# EAGLE design EC 4 Pin 2.0 - edited (EAGLE 9.6.2)
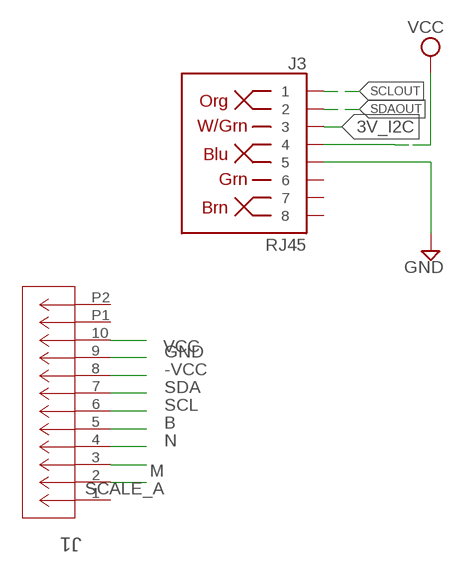
[diagram p0: schematic, sheet 1, part 1 of 2]
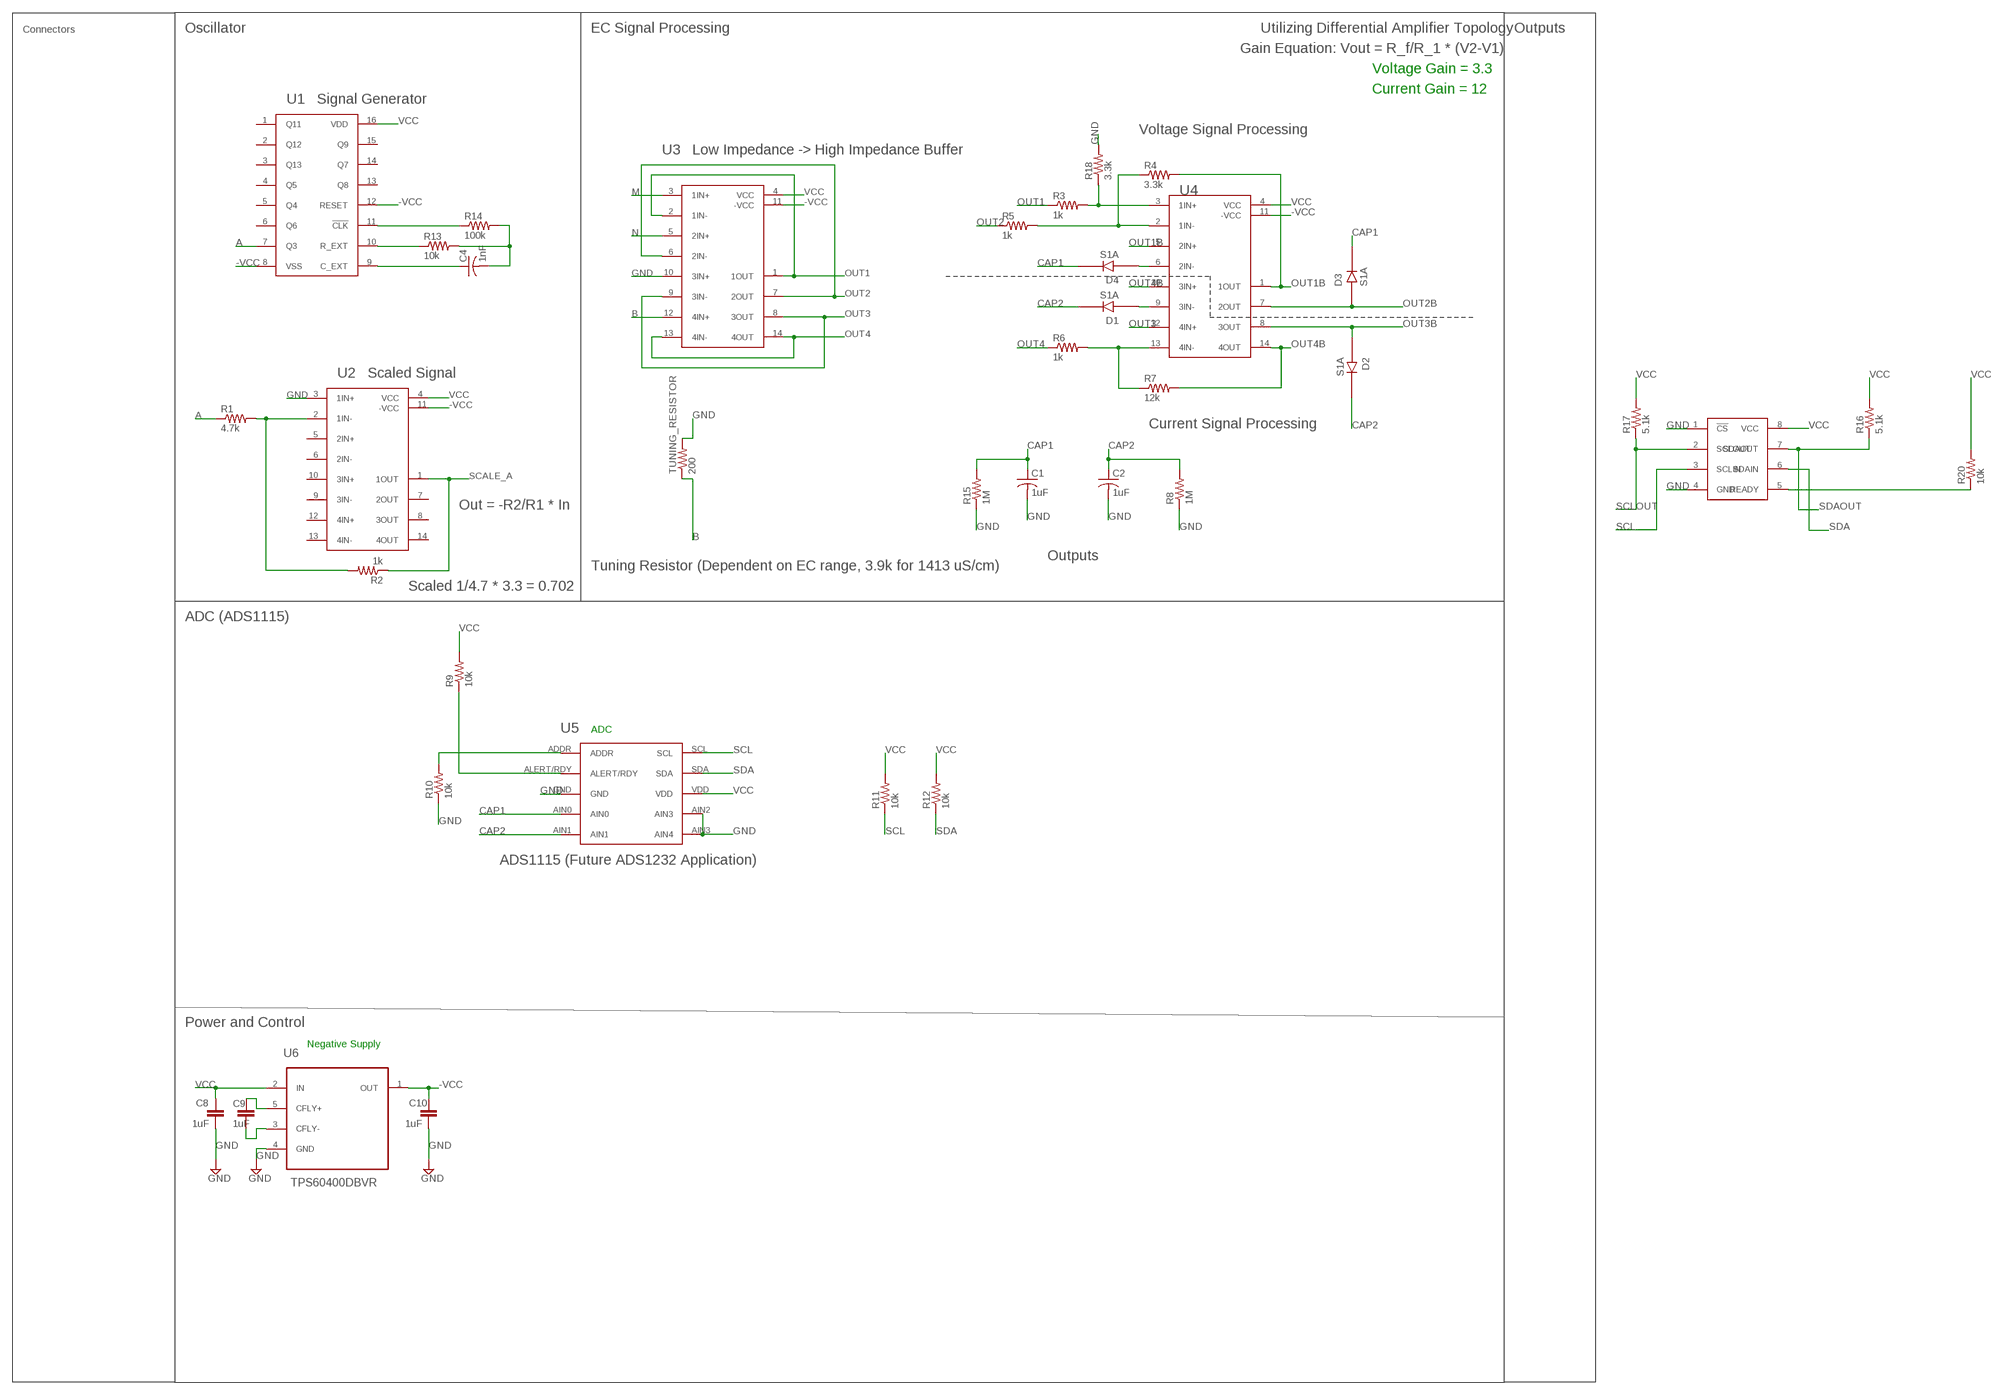
[diagram p1: schematic, sheet 1, part 2 of 2]

## Parts
C1  1uF  C-US025-024X044  [C025-024X044]
C2  1uF  C-US025-024X044  [C025-024X044]
C4  1nF  C-USC1206  [C1206]
C8  1uF  C-EUC1206  [C1206]
C9  1uF  C-EUC1206  [C1206]
C10  1uF  C-EUC1206  [C1206]
D1  S1A  [DIOM5227X270N]
D2  S1A  [DIOM5227X270N]
D3  S1A  [DIOM5227X270N]
D4  S1A  [DIOM5227X270N]
J1  522711079  [CON_522711079_MOL]
J3  RJ45  RJ45-8  [RJ45-8]
R1  4.7k  R-US_M1206  [M1206]
R2  1k  R-US_M1206  [M1206]
R3  1k  R-US_M1206  [M1206]
R4  3.3k  R-US_M1206  [M1206]
R5  1k  R-US_M1206  [M1206]
R6  1k  R-US_M1206  [M1206]
R7  12k  R-US_M1206  [M1206]
R8  1M  R-US_M1206  [M1206]
R9  10k  R-US_M1206  [M1206]
R10  10k  R-US_M1206  [M1206]
R11  10k  R-US_M1206  [M1206]
R12  10k  R-US_M1206  [M1206]
R13  10k  R-US_M1206  [M1206]
R14  100k  R-US_M1206  [M1206]
R15  1M  R-US_M1206  [M1206]
R16  5.1k  R-US_M1206  [M1206]
R17  5.1k  R-US_M1206  [M1206]
R18  3.3k  R-US_M1206  [M1206]
R20  10k  R-US_M1206  [M1206]
TUNING_RESISTOR  200  R-US_M1206  [M1206]
U1  CD4060BPWR  [CD4060BPWR]
U2  TL074CPWR  [LT074CPWR]
U3  TL074CPWR  [LT074CPWR]
U4  TL074CPWR  [LT074CPWR]
U5  ADS1115  [ADS1115]
U6  TPS60400DBVR  [SOT95P280X145-5N]
U$1  LTC4301  [LTC4301]

## Nets
3V_I2C: J3.3
-VCC: C10.2 J1.8 U1.8(VSS) U1.12(RESET) U2.11(-VCC) U3.11(-VCC) U4.11(-VCC) U6.1(OUT)
A: R1.1 U1.7(Q3)
B: J1.5 TUNING_RESISTOR.1 U3.12(4IN+)
CAP1: C1.1 D3.1(C) D4.1(C) R15.2 U5.AIN0
CAP2: C2.1 D1.1(C) D2.1(C) R8.2 U5.AIN1
GND: C1.2 C2.2 C8.1 C10.1 J1.9 J3.5 R8.1 R10.1 R15.1 R18.2 TUNING_RESISTOR.2 U2.3(1IN+) U3.10(3IN+) U5.AIN2(AIN3) U5.AIN3(AIN4) U5.GND U6.4(GND) U$1.1(!CS) U$1.4(GND)
M: J1.3 U3.3(1IN+)
N: J1.4 U3.5(2IN+)
N$1: R3.2 R18.1 U4.3(1IN+)
N$2: R4.1 R5.2 U4.2(1IN-)
N$3: R1.2 R2.2 U2.2(1IN-)
N$4: D4.2(A) U4.6(2IN-)
N$5: R6.2 R7.1 U4.13(4IN-)
N$6: D1.2(A) U4.9(3IN-)
N$10: C4.1 U1.9(C_EXT)
N$11: R13.1 U1.10(R_EXT)
N$12: R14.1 U1.11(!CLK)
N$13: R10.2 U5.ADDR
N$15: R9.1 U5.ALERT/RDY
N$16: R20.1 U$1.5(READY)
N$17: C4.2 R13.2 R14.2
N$27: C9.2 U6.5(CFLY+)
N$28: C9.1 U6.3(CFLY-)
OUT1: R3.1 U3.1(1OUT) U3.2(1IN-)
OUT1B: R4.2 U4.1(1OUT) U4.5(2IN+)
OUT2: R5.1 U3.6(2IN-) U3.7(2OUT)
OUT2B: D3.2(A) U4.7(2OUT)
OUT3: U3.8(3OUT) U3.9(3IN-) U4.12(4IN+)
OUT3B: D2.2(A) U4.8(3OUT)
OUT4: R6.1 U3.13(4IN-) U3.14(4OUT)
OUT4B: R7.2 U4.10(3IN+) U4.14(4OUT)
SCALE_A: J1.2 R2.1 U2.1(1OUT)
SCL: J1.6 R11.1 U5.SCL U$1.3(SCLIN)
SCLOUT: J3.1 R17.1 U$1.2(SCLOUT)
SDA: J1.7 R12.1 U5.SDA U$1.6(SDAIN)
SDAOUT: J3.2 R16.1 U$1.7(SDAOUT)
VCC: C8.2 J1.10 J3.4 R9.2 R11.2 R12.2 R16.2 R17.2 R20.2 U1.16(VDD) U2.4(VCC) U3.4(VCC) U4.4(VCC) U5.VDD U6.2(IN) U$1.8(VCC)
Unconnected: J1.1 J1.P1 J1.P2 J3.6 J3.7 J3.8 U1.1(Q11) U1.2(Q12) U1.3(Q13) U1.4(Q5) U1.5(Q4) U1.6(Q6) U1.13(Q8) U1.14(Q7) U1.15(Q9) U2.5(2IN+) U2.6(2IN-) U2.7(2OUT) U2.8(3OUT) U2.9(3IN-) U2.10(3IN+) U2.12(4IN+) U2.13(4IN-) U2.14(4OUT)

## Notes on the sheet
- Connectors | Oscillator | EC Signal Processing | Utilizing Differential Amplifier Topology | Outputs
- Gain Equation: Vout = R_f/R_1 * (V2-V1)
- Voltage Gain = 3.3
- Current Gain = 12
- U1 | Signal Generator
- Voltage Signal Processing
- U3 | Low Impedance -> High Impedance Buffer
- U4
- U2 | Scaled Signal
- Current Signal Processing
- Out = -R2/R1 * In
- Outputs
- Tuning Resistor (Dependent on EC range, 3.9k for 1413 uS/cm)
- Scaled 1/4.7 * 3.3 = 0.702
- ADC (ADS1115)
- U5 | ADC
- ADS1115 (Future ADS1232 Application)
- Power and Control
- Negative Supply

## Library data of the parts
C1 C2 C4 = adafruit:C-US: CAPACITOR, American symbol
C8-C10 = rcl:C-EU: CAPACITOR, European symbol; SPICEPREFIX: C
D1-D4 = S1A:S1A: Rectifier Diode Switching 50V 1A 2-Pin DO-214AC T/R Rectifier Diode Switching 50V 1A 2-Pin DO-214AC T/R; DESCRIPTION: Diode Standard 50 V 1A Surface Mount DO-214AC (SMA); DIGI-KEY_PART_NUMBER: S1AFSTR-ND; MF: ON Semiconductor; MP: S1A; PACKAGE: SMA-2 ON Semiconductor; PURCHASE-URL: https://pricing.snapeda.com/search/part/S1A/?ref=eda
J1 = 52271109:522711079; COPYRIGHT: Copyright (C) 2023 Ultra Librarian. All rights reserved.; MANUFACTURER_PART_NUMBER: 522711079; MFR_NAME: Molex Connector Corporation
J3 = SparkFun-Connectors:RJ45-8: RJ45 Jack - 8 pin Simple RJ45, 8-pin connection. Commonly used for Cat5, Cat5e, and Cat6 Ethernet cables. Here is the connector we sell at SparkFun: RJ45 8-Pin Connector <https://www.sparkfun.com/products/643> (PRT-00643) Datasheet <https://cdn.sparkfun.com/datasheets/Prototyping/04908.pdf> It is used on this SparkFun product: SparkFun RJ45 Breakout <https://www.sparkfun.com/products/716> (BOB-00716) Note, you may also be interested in the "MAGJACK" version of this. It is basically a RJ45 connector, but also has some status LEDs built into the connector housing. You can check that out in this library at the device named "MAGJACK.dev" and see these products online: RJ45 Ethernet MagJack-Compatible <https://www.sparkfun.com/products/8534> (PRT-08534) SparkFun RJ45 MagJack Breakout <https://www.sparkfun.com/products/13021> (BOB-13021); PROD_ID: CONN-08506; SF_ID: PRT-00643
R1-R18 R20 TUNING_RESISTOR = adafruit:R-US_: RESISTOR, American symbol
U1 = PNNL_Wenner:CD4060BPWR
U2-U4 = PNNL_Wenner:TL074CPWR
U5 = my_lib:ADS1115
U6 = TPS60400DBVR:TPS60400DBVR: Unregulated 60mA charge pump Voltage Inverter; AVAILABILITY: Unavailable; DESCRIPTION: 60mA Charge Pump Voltage Inverter with Variable Switching Frequency 5-SOT-23 -40 to 85; MF: Texas Instruments; MP: TPS60400DBVR; PACKAGE: SOT-23-5 Texas Instruments; PRICE: None
U$1 = my_lib:LTC4301

## Net classes
0 default: width 0.305 mm

## Board
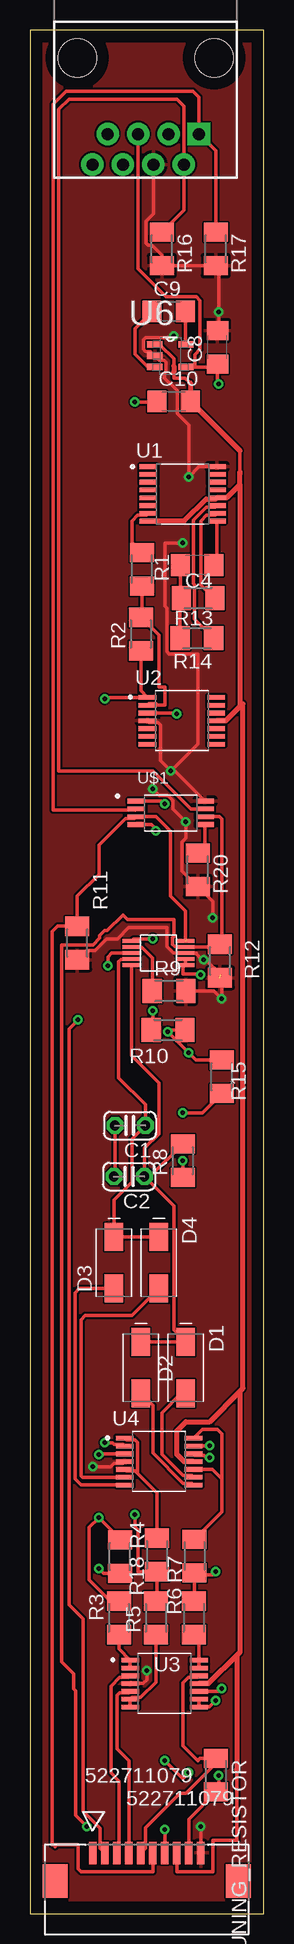
[diagram p2: board, top side]
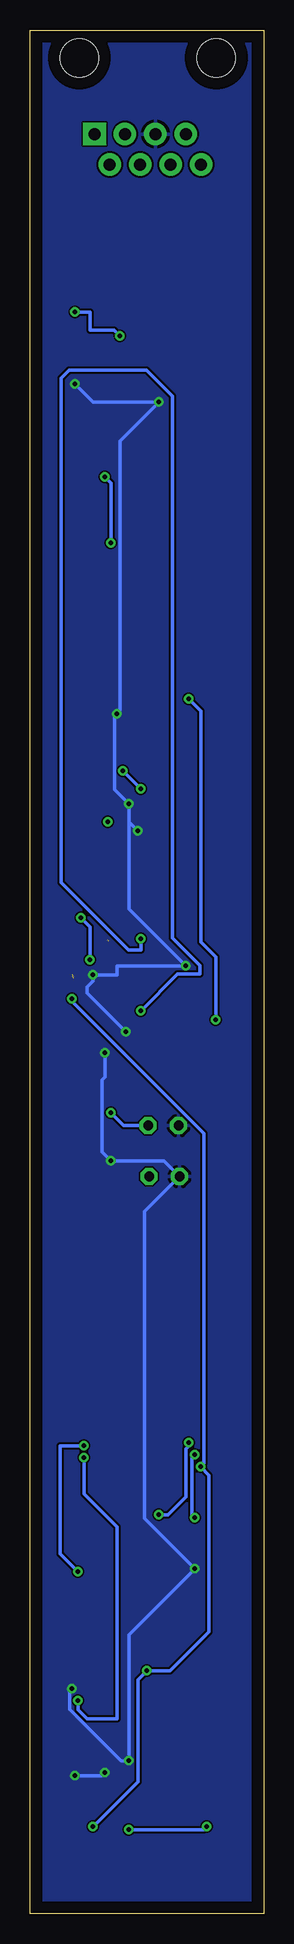
[diagram p3: board, bottom side, seen from below]

Size 19.5 x 157 mm. Coordinates in mm from the lower left corner, seen from the top.
Outline: 0,0 19.5,0 19.5,157 0,157 0,0
Copper layers (1*16): Top 0.035mm / dielectric 1.5mm / Bottom 0.035mm
Design rules "default": minimum track width 6mil, minimum drill 0.35mm, track to track 6mil, track to pad 6mil, pad to pad 6mil, via to via 6mil, smd to smd 6mil, copper to edge 40mil, drill to drill 6mil, minimum pad ring 10mil, minimum via ring 8mil, stop-mask expansion 4mil, vias tented up to drill 0mil, thermal gap 10mil

### Footprints (pad centres in the part's own frame; a part is rotated, then mirrored left to right if it is on the bottom)
C025-024X044 = drill 0.813 pad 1.422 octagon: 1 -1.27,0; 2 1.27,0
C1206 = smd 1.6 x 1.8: 1 -1.4,0; 2 1.4,0
DIOM5227X270N = smd 2.33 x 1.56: 1 -2.14,0; 2 2.14,0
CON_522711079_MOL = smd 0.6 x 1.9: 1 -4.5,3.05; 2 -3.5,3.05; 3 -2.5,3.05; 4 -1.5,3.05; 5 -0.5,3.05; 6 0.5,3.05; 7 1.5,3.05; 8 2.5,3.05; 9 3.5,3.05; 10 4.5,3.05 | smd 2.1 x 2.8: P1 -7.65,0.7; P2 7.65,0.7
RJ45-8 = drill 1 pad 1.88 square: 1 -4.445,6.35 | drill 1 pad 1.88: 2 -3.175,8.89; 3 -1.905,6.35; 4 -0.635,8.89; 5 0.635,6.35; 6 1.905,8.89; 7 3.175,6.35; 8 4.445,8.89 | hole 3.2: -5.715,0; 5.715,0
M1206 = smd 1.6 x 2: 1 -1.4,0; 2 1.4,0
CD4060BPWR = smd 1.57 x 0.41: 1 -2.87,2.275; 2 -2.87,1.625; 3 -2.87,0.975; 4 -2.87,0.325; 5 -2.87,-0.325; 6 -2.87,-0.975; 7 -2.87,-1.625; 8 -2.87,-2.275; 9 2.87,-2.275; 10 2.87,-1.625; 11 2.87,-0.975; 12 2.87,-0.325; 13 2.87,0.325; 14 2.87,0.975; 15 2.87,1.625; 16 2.87,2.275
LT074CPWR = smd 1.57 x 0.41: 1 -2.87,1.95; 2 -2.87,1.3; 3 -2.87,0.65; 4 -2.87,0; 5 -2.87,-0.65; 6 -2.87,-1.3; 7 -2.87,-1.95; 8 2.87,-1.95; 9 2.87,-1.3; 10 2.87,-0.65; 11 2.87,0; 12 2.87,0.65; 13 2.87,1.3; 14 2.87,1.95
ADS1115 = smd 1.5 x 0.318: ADDR -0.75,2.5; AIN0 -0.75,1; AIN1 -0.75,0.5; AIN2 3.75,0.5; AIN3 3.75,1; ALERT/RDY -0.75,2; GND -0.75,1.5; SCL 3.75,2.5; SDA 3.75,2; VDD 3.75,1.5
SOT95P280X145-5N = smd 1.27 x 0.559: 1 -1.295,0.94; 2 -1.295,0; 3 -1.295,-0.94; 4 1.295,-0.94; 5 1.295,0.94
LTC4301 = smd 1.57 x 0.41: 1 -2.87,0.975; 2 -2.87,0.325; 3 -2.87,-0.325; 4 -2.87,-0.975; 5 2.87,-0.975; 6 2.87,-0.325; 7 2.87,0.325; 8 2.87,0.975

### Placement (x,y rotation side)
C1  8.36,65.68 180 top
C2  8.28,61.43 180 top
C4  13.96,112.4 180 top
C8  15.66,130.55 90 top
C9  11.58,133.55 0 top
C10  12,126.05 0 top
D1  13,45.5 270 top
D2  9.25,45.5 270 top
D3  7,54.25 270 top
D4  10.75,54.25 270 top
J1  9.75,2 0 top
J3  9.66,154.68 180 top
R1  9.34,112.05 270 top
R2  9.26,106.65 90 top
R3  7.43,24.65 90 top
R4  10.6,29.9 90 top
R5  10.52,24.65 90 top
R6  13.69,24.65 90 top
R7  13.74,29.8 90 top
R8  12.75,62.75 90 top
R9  11.61,76.9 0 top
R10  11.53,73.65 180 top
R11  3.95,80.9 270 top
R12  15.87,79.4 270 top
R13  14.04,109.65 180 top
R14  13.94,106.3 180 top
R15  16,69.75 270 top
R16  11,138.75 270 top
R17  15.5,138.75 270 top
R18  7.5,29.75 270 top
R20  14,87 270 top
TUNING_RESISTOR  15.54,11.55 270 top
U1  12.75,118.33 0 top
U2  12.68,99.42 0 top
U3  11.23,19.17 0 top
U4  10.78,37.67 0 top
U5  9.21,78.56 0 top
U6  11.72,129.85 0 top
U$1  11.75,91.75 0 top

### Tracks (layer width: path | path; a pad name or v marks a point on that pad's centre or on a via)
-VCC
  Top 0.305: 17.53,121.92 17.53,120 | 10.46,130.75 10.87,130.75 12,129.62 12,129 | 13.35,127.6 12.95,128 12,128 12,128.5 | J1.8 12.25,3.5 15.25,3.5 15.25,6.12 17.25,6.12 17.25,10 17.25,12 | J1.8
  Top 0.406: 10.46,130.75 U6.1 | 13.35,127.6 13.4,127.55 C10.2 17.53,121.92 | 12,129 12,128.5 | U1.8 12.86,116.06 14.72,117.92 15.53,117.92 U1.12 16.43,118 17.53,119.1 | U2.11 16.36,99.42 17.53,100.59 | U3.11 14.91,19.17 17.25,21.51 | 17.53,43.53 17.53,21.79 17.25,21.51 | U4.11 12.84,37.67 12.25,38.26 12.25,40.25 13,41 15,41 17.53,43.53 | 17.53,43.53 17.78,43.78 17.78,100.84 17.53,100.59 | 17.53,119.1 17.53,120 17.53,120.17 | 17.53,119.1 17.53,100.59 | 17.25,21.51 17.25,12
A
  Top 0.305: U1.7 9.74,116.56 9,116.56 8.5,116.07 8.5,114.29 R1.1
B
  Top 0.305: U3.12 13.96,19.68 13.22,19.68 12.75,19.21 12.75,14 14,12.75 14.2,12.95 TUNING_RESISTOR.1 15.54,12.53 13.02,10 12.54,10 12.48,9.95 12.48,9.97 9.65,7.13 9.65,5.45 J1.5
CAP1  (via drill 0.35)
  Top 0.305: D4.1 D3.1 7,59.5 8.5,61 8.5,64.55 C1.1 9.63,67.43 7.41,69.66 7.41,79.34 7.58,79.52 8.42,79.52 U5.AIN0 | R15.2 14.4,66.75 v12.75,66.75
  Bottom 0.305: C1.1 11.68,65.68 v12.75,66.75
CAP2
  Top 0.305: D2.1 D1.1 12,48.64 12,58.98 C2.1 | C2.1 9.55,63.8 10.75,65 10.75,69.25 8.46,71.54 U5.AIN1 | C2.1 10.03,61.43 R8.2
GND  (via drill 0.35)
  Top 0.305: 12.92,79.6 U5.AIN3 U5.AIN2 12.75,78.85 12.75,78.31 14.19,78.31 v14.25,78.25 | U6.4 13.75,128.91 | 13.75,128.91 15.42,128.91 C8.1 15.66,127.59 v15.75,127.5 | U3.10 15.77,18.52 v16,18.75 | R10.1 11.65,73.65 v11.5,73.5 v13.25,71.75 13.85,71.15 R15.1 15.15,71.15 | U5.GND 6.81,80.06 6.5,79.75 v6.5,79 | U2.3 12.18,100.07 v12.25,100 | C10.1 10.55,126 v8.75,126 | R8.1 v12.75,62.75 | v15.75,11.5 15.75,10.15 TUNING_RESISTOR.2 13.25,7.86 J1.9 | v11.25,12.75 12.75,11.25 v13.25,11.75 | U$1.1 11.02,92.72 v11.25,92.5 | U$1.4 10.13,90.78 10.5,90.41 v10.5,90.25 | R18.2 6.15,28.35 v5.75,28.75 | 13.75,128.91 13.75,129.93 14.2,130.38 14.2,134.46 13.91,134.75 11.36,134.75 9.02,137.09 J3.5 | C1.2 7.09,61.51 C2.2 | J1.9
  Bottom 0.305: v11.25,92.5 11.25,83.75 v6.5,79 12.25,79 12.25,78.25 v14.25,78.25 14.25,77.75 14.75,77.25 14.75,76.75 v11.5,73.5 | v15.75,127.5 14.25,126 v8.75,126 12,122.75 12,100.25 v12.25,100 12.43,99.82 12.43,93.68 v11.25,92.5 | v10.5,90.25 11.25,91 v11.25,92.5 | v15.75,11.5 13.5,11.5 v13.25,11.75 | v16,18.75 16.18,18.57 16.18,17.04 11.9,12.75 v11.25,12.75 11.25,23.25 v5.75,28.75 9.93,32.93 9.93,58.51 C2.2 8.33,62.75 v12.75,62.75 13.5,63.5 13.5,69.5 13.25,69.75 v13.25,71.75
  pour Bottom: 0.25,157.25 19.5,157.25 19.5,0.25 0.25,0.25
M
  Top 0.305: U3.3 8.22,19.68 7.48,19.68 6.75,18.95 6.75,11.72 7.43,11.03 7.43,5.23 J1.3
N
  Top 0.305: U3.5 8.22,18.38 7.48,18.38 7.27,18.17 7.27,13.73 8.25,12.75 J1.4 8.25,5.75 | 8.25,5.75
N$1  (via drill 0.35)
  Top 0.305: v5.75,38.25 5.82,38.32 U4.3 | R18.1 7.5,31.25 v5.75,33 4.93,32.18 4.93,27.8 6.68,26.05 R3.2
  Bottom 0.305: v5.75,38.25 6,38 6,33.25 v5.75,33
N$2  (via drill 0.35)
  Top 0.305: R5.2 10.6,26.13 R4.1 9,28.5 9,32 8.75,32.25 v8.75,33.25 | U4.2 7.77,39.11 7.03,39.11 6.89,39.25 v6.25,39.25
  Bottom 0.305: v8.75,33.25 8,33.25 6.5,34.75 6.5,38.75 6.25,39 v6.25,39.25
N$3
  Top 0.305: R1.2 9.34,108.13 R2.2 10.75,106.56 10.75,102.25 11.25,102.25 11.25,100.75 10.61,100.75 10.5,100.86 9.95,100.86 U2.2
N$4
  Top 0.305: D4.2 8.5,49.86 4.61,49.86 4.25,49.5 4.25,36.5 4.38,36.37 U4.6
N$5  (via drill 0.35)
  Top 0.305: R7.1 13.74,28.25 | 13.74,28.25 13.74,26.1 R6.2 | U4.13 13.68,39 v15,39 | v15.5,28.5 15.25,28.25 13.74,28.25
  Bottom 0.305: v15,39 17,39 17,30 v15.5,28.5
N$6
  Top 0.305: D1.2 12.61,43.36 11,41.75 11,38.28 12.77,36.51 13.51,36.51 U4.9
N$10
  Top 0.305: U1.9 15.62,112.66 C4.1
N$11
  Top 0.305: U1.10 15.48,116.56 14.74,116.56 14.25,116.08 14.25,110.75 15.35,109.65 R13.1
N$12
  Top 0.305: R14.1 13.74,107.89 13.74,110.78 13.66,110.86 13.66,116.14 14.74,117.22 15.48,117.22 U1.11
N$13  (via drill 0.35)
  Top 0.305: R10.2 10.25,73.77 v10.25,75.25 | U5.ADDR 8.65,81.25 v10.25,81.25
  Bottom 0.305: 10.25,80.32 11.28,80.32 16.89,85.92 16.89,127.97 16.22,128.64 9.78,128.64 7.61,126.47 7.61,81.33 5.32,79.03 5.32,78.32 7.18,78.32 v10.25,75.25 | 10.25,80.32 10.22,80.32 | 10.25,80.32 v10.25,81.25
N$15
  Top 0.305: U5.ALERT/RDY 8.5,80.52 9.34,80.52 10.21,79.65 R9.1
N$16
  Top 0.305: U$1.5 14.62,89.02 R20.1
N$17
  Top 0.305: R14.2 12.54,109.55 R13.2 12.56,109.73 C4.2
N$27
  Top 0.305: U6.5 12.98,130.82 C9.2
N$28
  Top 0.305: U6.3 9.84,128.91 8.75,130 8.75,132.12 C9.1
OUT1
  Top 0.305: U3.2 U3.1 7.43,22.05 R3.1
OUT1B
  Top 0.305: U4.5 8.05,36.88 8.79,36.88 9,36.67 | R4.2 10.6,35.07 9,36.67 | U4.1 8.05,39.48 8.79,39.48 9,39.27 9,36.67
OUT2
  Top 0.305: U3.7 U3.6 8.5,18.01 9.24,18.01 10.52,19.29 R5.1
OUT2B
  Top 0.305: U4.7 4.28,35.72 3.75,36.25 3.75,51.75 4.11,52.11 D3.2
OUT3  (via drill 0.35)
  Top 0.305: U3.9 U3.8 14.97,17.22 v15.5,17.75 | v15,38 14.71,38 14.53,38.18 13.79,38.18 U4.12
  Bottom 0.305: v15.5,17.75 15.5,17 14.75,16.25 12.25,16.25 12.25,32.25 15,35 v15,38
OUT3B
  Top 0.305: D2.2 10.25,42.36 10.25,38.38 12.77,35.86 13.51,35.86 U4.8
OUT4
  Top 0.305: U3.13 U3.14 14.1,22.84 R6.1
OUT4B
  Top 0.305: R7.2 16,33.46 16,36.25 | 16,36.25 16,40 15.63,40.37 14.4,40.37 U4.14 | U4.10 15.23,37.02 16,36.25
SCALE_A  (via drill 0.35)
  Top 0.305: R2.1 9.26,101.92 U2.1 6.37,101.37 v6.25,101.25 | v4,74.5 3.25,73.75 3.25,25.75 4.44,24.56 4.44,8.53 5.85,7.11 5.85,5.45 J1.2 6,5.3
  Bottom 0.305: v4,74.5 4,79.75 5.25,81 5.25,100.25 v6.25,101.25
SCL  (1 unrouted)
  Top 0.305: 2.1,5.75 2.1,5.54 | 13.03,81.13 12.96,81.21 12.96,83.56 11.71,84.81 11.71,90.22 10.5,91.42 U$1.3 8.74,91.28 8,91.28 5.76,89.05 5.76,86.61 3.95,84.8 R11.1 2.3,82.3 1.85,81.85 1.85,81.32 1.85,81.25 1.85,5.75 2.1,5.75 | 2.1,5.75 4,5.75 4,3.75 4.25,3.5 10.25,3.5 | 10.25,3.5 | 10.25,3.5 J1.6
SCLOUT
  Top 0.305: U$1.2 8.8,92 1.92,92 1.92,150.83 3,151.91 13.59,151.91 14.1,151.4 J3.1 15.5,146.94 R17.1
SDA  (via drill 0.35)
  Top 0.305: U$1.6 15.83,91.42 16,91.25 16,80.93 R12.1 15.87,80.56 U5.SDA 12.8,80.56 12.76,80.6 12.08,80.6 11.91,80.78 11.91,81.34 12.01,81.45 12.01,82.84 8.16,82.84 7.75,83.25 6.43,81.93 6.22,81.93 5.82,81.53 5.82,81.3 5.26,80.74 5.25,80.75 2.63,80.75 2.63,20.98 3.63,19.98 3.63,18.75 3.81,18.57 3.81,8.19 v4.75,7.25 | v11.25,7 | v11.25,7 J1.7
  Bottom 0.305: v11.25,7 5,7 v4.75,7.25
SDAOUT
  Top 0.305: R16.1 12.84,141.99 J3.2 12.84,150.66 12.25,151.25 3.25,151.25 2.38,150.38 2.38,95.25 10.25,95.25 13.42,92.08 U$1.7
VCC  (via drill 0.35)  (1 unrouted)
  Top 0.305: J3.4 10.3,141.68 9.7,141.08 9.7,139.22 9.87,139.04 10.2,139.04 11,138.25 R16.2 14.65,137.35 14.75,137.25 15.4,137.25 | 12.99,76.9 R9.2 15.35,76.9 v16,76.25 16,77.87 R12.2 | 15.4,137.25 R17.2 | 15.5,132.11 C8.2 15.75,132.04 v15.75,133.5 15.75,136.9 15.4,137.25 | 15.87,77.5 R12.2 | U5.VDD 12.12,80.06 | U5.VDD 11.97,80.06 11.42,80.61 11.42,82.18 8.24,82.18 7.31,81.25 6.41,81.25 5.44,80.28 4.73,80.28 R11.2 | 13.9,80.06 13.75,80.06 | 13.75,80.06 U5.VDD | R12.2 15.46,78 | 13.75,80.06 13.79,80.02 13.84,80.02 14.36,79.5 v14.5,79.5 14.71,79.5 15.93,78.27 | v15.25,83 15.25,84.35 R20.2 12.7,86.91 12.7,89.33 13,89.63 v13,91 11.93,92.07 11.93,92.78 11.53,93.18 10.82,93.18 v10.25,93.75 | v11.75,95.25 12.09,95.25 U$1.8 | v12,131.5 11.87,131.37 9.66,131.37 9.48,131.19 9.48,130.38 9.66,130.21 10.07,130.21 U6.2 10.78,129.49 11.19,129.49 11.36,129.32 11.36,128.5 11.24,128.38 11.24,127.99 12.3,126.94 12.3,125.02 13.25,124.07 v13.25,119.75 14.1,120.6 U1.16 | v11.75,95.25 10.9,96.1 10.9,99.07 10.69,99.28 9.95,99.28 U2.4 | v11.75,95.25 14,97.5 14,105 11.61,105 11.44,105.17 11.44,108.81 11.25,109 11.25,114.25 v12.75,114.25 | v9.75,20.25 9.75,19.5 9.42,19.17 U3.4 | v14.25,7.25 J1.10 | J1.10 | U4.4 7.77,37.53 7.03,37.53 6.75,37.25 v5.25,37.25
  Bottom 0.305: v11.75,95.25 v10.25,93.75 | v14.5,79.5 14.5,82.25 v15.25,83 | v13.25,119.75 12.75,119.25 v12.75,114.25 | v14.25,7.25 10.5,11 10.5,19.5 v9.75,20.25 7.82,20.25 4.57,23.5 4.57,36.53 5.25,37.22 v5.25,37.25 4.99,37.51 4.99,65.03 16,76.03 v16,76.25 | v15.75,133.5 14.5,133.5 14.5,132 12.5,132 v12,131.5
  pour Top: 19.5,157.25 19.5,0.25 0.25,0.25 0.25,157.25